# EAGLE schematic BT_atmega_v_1_0 (EAGLE 6.5.0)
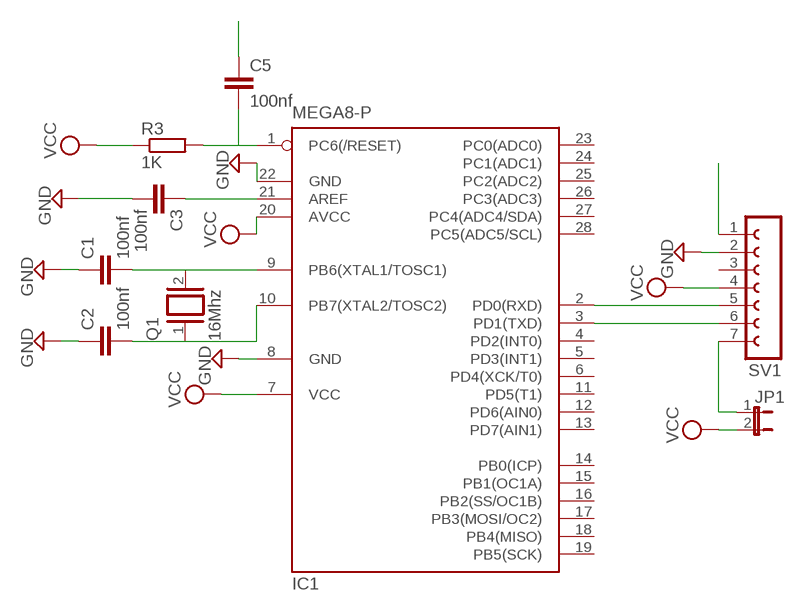
[diagram p0: schematic, sheet 1]

## Parts
C1  100nf  C2.5/2  [C2.5-2]
C2  100nf  C2.5/2  [C2.5-2]
C3  100nf  C2.5/2  [C2.5-2]
C5  100nf  C2.5/2  [C2.5-2]
IC1  MEGA8-P  [DIL28-3]
JP1  JP1E  [JP1]
Q1  16Mhz  XTAL/S  [QS]
R3  1K  R0204/7  [0204/7]
SV1  FE07-1  [FE07]

## Nets
BT_RST: C5.1 SV1.1
GND: C1.1 C2.1 C3.2 IC1.8(GND) IC1.22(GND) SV1.2
N$1: C1.2 IC1.9(PB6(XTAL1/TOSC1)) Q1.2
N$2: C2.2 IC1.10(PB7(XTAL2/TOSC2)) Q1.1
N$3: C5.2 IC1.1(PC6(/RESET)) R3.2
N$4: C3.1 IC1.21(AREF)
N$5: IC1.2(PD0(RXD)) SV1.5
N$6: IC1.3(PD1(TXD)) SV1.6
N$7: JP1.1 SV1.7
VCC: IC1.7(VCC) IC1.20(AVCC) JP1.2 R3.1 SV1.4
Unconnected: IC1.4(PD2(INT0)) IC1.5(PD3(INT1)) IC1.6(PD4(XCK/T0)) IC1.11(PD5(T1)) IC1.12(PD6(AIN0)) IC1.13(PD7(AIN1)) IC1.14(PB0(ICP)) IC1.15(PB1(OC1A)) IC1.16(PB2(SS/OC1B)) IC1.17(PB3(MOSI/OC2)) IC1.18(PB4(MISO)) IC1.19(PB5(SCK)) IC1.23(PC0(ADC0)) IC1.24(PC1(ADC1)) IC1.25(PC2(ADC2)) IC1.26(PC3(ADC3)) IC1.27(PC4(ADC4/SDA)) IC1.28(PC5(ADC5/SCL)) SV1.3

## Library data of the parts
C1-C3 C5 = capacitor-wima:C: CAPACITOR naming: grid - package width
IC1 = atmel:MEGA8-P: MICROCONTROLLER 8 Kbytes FLASH, 1 kbytes SRAM, 512 bytes EEPROM, USART, 4-channel 10 bit ADC, 2-channel 8 bit ADC Pin compatible with Atmega48, ATMega88, ATMega168 Source: avr.lbr; OC_FARNELL: unknown; OC_NEWARK: unknown
JP1 = jumper:JP1E: JUMPER
Q1 = special:XTAL/S: CRYSTAL
R3 = eagle-ltspice:R: RESISTOR, European symbol; SPICEMODEL: NONE; SPICEPREFIX: R
SV1 = con-lsta:FE07-1: FEMALE HEADER; OC_FARNELL: unknown; OC_NEWARK: unknown